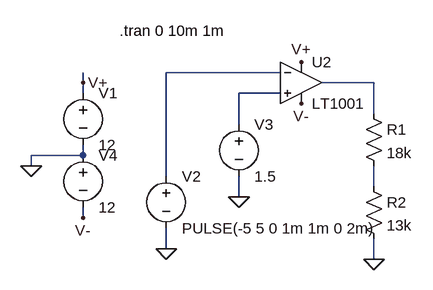
[diagram p0: schematic pwm.asc]
pwm.asc, the LTspice schematic file:
Version 4
SHEET 1 1024 680
WIRE 320 208 144 208
WIRE 16 224 16 208
WIRE 464 224 384 224
WIRE 16 240 16 224
WIRE 320 240 256 240
WIRE 464 272 464 224
WIRE 256 288 256 240
WIRE 16 336 16 320
WIRE 16 336 -64 336
WIRE -64 352 -64 336
WIRE 144 368 144 208
WIRE 464 384 464 352
WIRE 256 400 256 368
WIRE 16 432 16 416
WIRE 144 480 144 448
WIRE 464 496 464 464
FLAG 144 480 0
FLAG -64 352 0
FLAG 256 400 0
FLAG 16 224 V+
FLAG 464 496 0
FLAG 16 432 V-
FLAG 352 192 V+
FLAG 352 256 V-
SYMBOL voltage 16 224 R0
SYMATTR InstName V1
SYMATTR Value 12
SYMBOL voltage 144 352 R0
SYMATTR InstName V2
SYMATTR Value PULSE(-5 5 0 1m 1m 0 2m)
SYMBOL res 448 256 R0
SYMATTR InstName R1
SYMATTR Value 18k
SYMBOL voltage 256 272 R0
SYMATTR InstName V3
SYMATTR Value 1.5
SYMBOL voltage 16 320 R0
SYMATTR InstName V4
SYMATTR Value 12
SYMBOL OpAmps/LT1001 352 160 R0
SYMATTR InstName U2
SYMBOL res 448 368 R0
SYMATTR InstName R2
SYMATTR Value 13k
TEXT 72 144 Left 2 !.tran 0 10m 1m

The netlist it stands for:
* pwm.asc
V1 V+ 0 12
V2 N001 0 PULSE(-5 5 0 1m 1m 0 2m)
R1 N002 N004 18k
V3 N003 0 1.5
V4 0 V- 12
XU2 N003 N001 V+ V- N002 LT1001  ; pins In+ In- V+ V- OUT
R2 N004 0 13k
.tran 0 10m 1m
.lib LTC.lib
.backanno
.end